# EAGLE design janus (EAGLE 7.5.0)
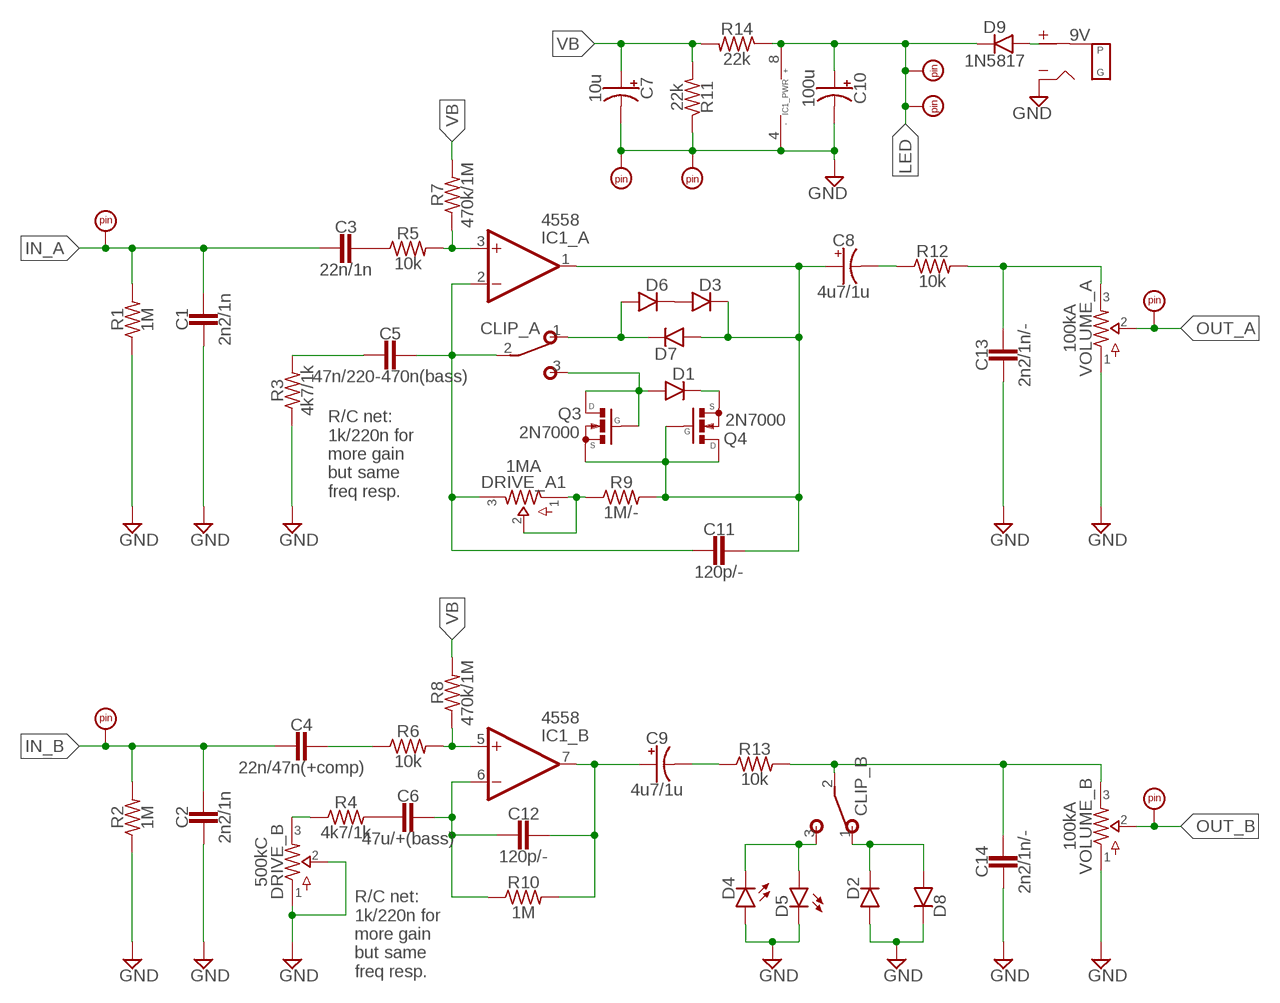
[diagram p0: schematic, sheet 1]

## Parts
9V  DC_MONO  [DC]
C1  2n2/1n  CER/FILM2  [050X030_025_2]
C2  2n2/1n  CER/FILM2  [050X030_025_2]
C3  22n/1n  CER/FILM2  [050X030_025_2]
C4  22n/47n(+comp)  CER/FILM2  [050X030_025_2]
C5  47n/220-470n(bass)  CER/FILM2  [050X030_025_2]
C6  47u/+(bass)  CER/FILM2  [050X030_025_2]
C7  10u  0501  [050_020_1]
C8  4u7/1u  0501  [050_020_1]
C9  4u7/1u  0501  [050_020_1]
C10  100u  0501  [050_020_1]
C11  120p/-  CER/FILM2  [050X030_025_2]
C12  120p/-  CER/FILM2  [050X030_025_2]
C13  2n2/1n/-  CER/FILM2  [050X030_025_2]
C14  2n2/1n/-  CER/FILM2  [050X030_025_2]
CLIP_A  SPDTPADS  [SPDT]
CLIP_B  SPDTPADS  [SPDT]
D1  DO35.2  [DO35-2]
D2  DO35.2  [DO35-2]
D3  DO35.2  [DO35-2]
D4  LEDB  [3MM_B]
D5  LEDB  [3MM_B]
D6  DO35.2  [DO35-2]
D7  DO35.2  [DO35-2]
D8  DO35.2  [DO35-2]
D9  1N5817  DO41.3  [DO41-3]
DRIVE_A1  1MA  POTS16MM  [16MM]
DRIVE_B  500kC  POTS16MM  [16MM]
GNDA  PADRND  [ROUND]
GNDB  PADRND  [ROUND]
IC1  4558  DUALTH  [DIL08]
INA  PADSQR  [SQUARE]
INB  PADSQR  [SQUARE]
LEDA  PADRND  [ROUND]
LEDB  PADRND  [ROUND]
OUTA  PADSQR  [SQUARE]
OUTB  PADSQR  [SQUARE]
Q3  2N7000  BS170  [SOT54ES]
Q4  2N7000  BS170  [SOT54ES]
R1  1M  R_.3B  [R0207/3]
R2  1M  R_.3B  [R0207/3]
R3  4k7/1k  R_.3B  [R0207/3]
R4  4k7/1k  R_.3B  [R0207/3]
R5  10k  R_.3B  [R0207/3]
R6  10k  R_.3B  [R0207/3]
R7  470k/1M  R_.3B  [R0207/3]
R8  470k/1M  R_.3B  [R0207/3]
R9  1M/-  R_.3B  [R0207/3]
R10  1M  R_.3B  [R0207/3]
R11  22k  R_.3B  [R0207/3]
R12  10k  R_.3B  [R0207/3]
R13  10k  R_.3B  [R0207/3]
R14  22k  R_.3B  [R0207/3]
VOLUME_A  100kA  POTS16MM  [16MM]
VOLUME_B  100kA  POTS16MM  [16MM]

## Nets
GND: 9V.S(SLEEVE) C1.2 C2.2 C7.- C10.- C13.2 C14.2 D2.A D4.A D5.K(C) D8.C DRIVE_B.1 DRIVE_B.2 GNDA.1 GNDB.1 IC1.4(_PWR:V-) R1.1 R2.1 R3.1 R11.1 VOLUME_A.1 VOLUME_B.1
IN_A: C1.1 C3.2 INA.1 R1.2
IN_B: C2.1 C4.2 INB.1 R2.2
LED: C10.+ D9.C IC1.8(_PWR:V+) LEDA.1 LEDB.1 R14.1
N$1: C3.1 R5.1
N$2: C5.2 R3.2
N$3: C8.- R12.1
N$4: C4.1 R6.1
N$5: IC1.3(_A:+IN) R5.2 R7.1
N$6: DRIVE_A1.1 DRIVE_A1.2 R9.1
N$7: C5.1 C11.2 CLIP_A.2(P) DRIVE_A1.3 IC1.2(_A:-IN)
N$8: D1.C Q4.S
N$10: C13.1 R12.2 VOLUME_A.3
N$11: CLIP_B.1(O) D2.C D8.A
N$12: C6.2 R4.2
N$13: C9.- R13.1
N$14: 9V.T(TIP) D9.A
N$15: C8.+ C11.1 D3.C D7.A IC1.1(_A:OUT) Q3.S Q4.D Q4.G R9.2
N$16: IC1.5(_B:+IN) R6.2 R8.1
N$17: C9.+ C12.1 IC1.7(_B:OUT) R10.2
N$18: C6.1 C12.2 IC1.6(_B:-IN) R10.1
N$19: CLIP_B.3(S) D4.K(C) D5.A
N$21: C14.1 CLIP_B.2(P) R13.2 VOLUME_B.3
N$22: DRIVE_B.3 R4.1
N$23: CLIP_A.3(S) D1.A Q3.D Q3.G
N$24: D3.A D6.C
N$25: CLIP_A.1(O) D6.A D7.C
OUT_A: OUTA.1 VOLUME_A.2
OUT_B: OUTB.1 VOLUME_B.2
VB: C7.+ R7.2 R8.2 R11.2 R14.2

## Notes on the sheet
- R/C net:
  1k/220n for 
  more gain 
  but same 
  freq resp.
- R/C net:
  1k/220n for 
  more gain 
  but same 
  freq resp.

## Library data of the parts
9V = jacks:DC_MONO
C1-C6 C11-C14 = capacitors-film:CER/FILM: 47 - 120pF Xicon Ceramic Disc 2.5mm lead spacing
C7-C10 = capacitors-elec:050: 0.22 - 100uF Xicon values at Mouser.com: 10V: 10 - 100uF; 16V: 2.2 - 47uF; 25V: 0.47 - 47uF; 50V: 0.22 - 22uF
CLIP_A CLIP_B = switches:SPDT: TOGGLE SWITCH Marquardt
D1-D3 D6-D8 = diodes:DO35: DO-35 Package Diodes: 1N914
D4 D5 = diodes:LED
D9 = diodes:DO41: DO-41 Package Diodes: 1N4001 - 1N40019 Zener Diodes: 1N4728 - 1N4764
DRIVE_A1 DRIVE_B VOLUME_A VOLUME_B = potentiometers:POTS
GNDA GNDB INA INB LEDA LEDB OUTA OUTB = supply pins:PAD
IC1 = integrated circuits:DUAL: OP AMP
Q3 Q4 = transistors:BS170: N-CHANNEL MOS FET
R1-R14 = resistors:R_

## Board
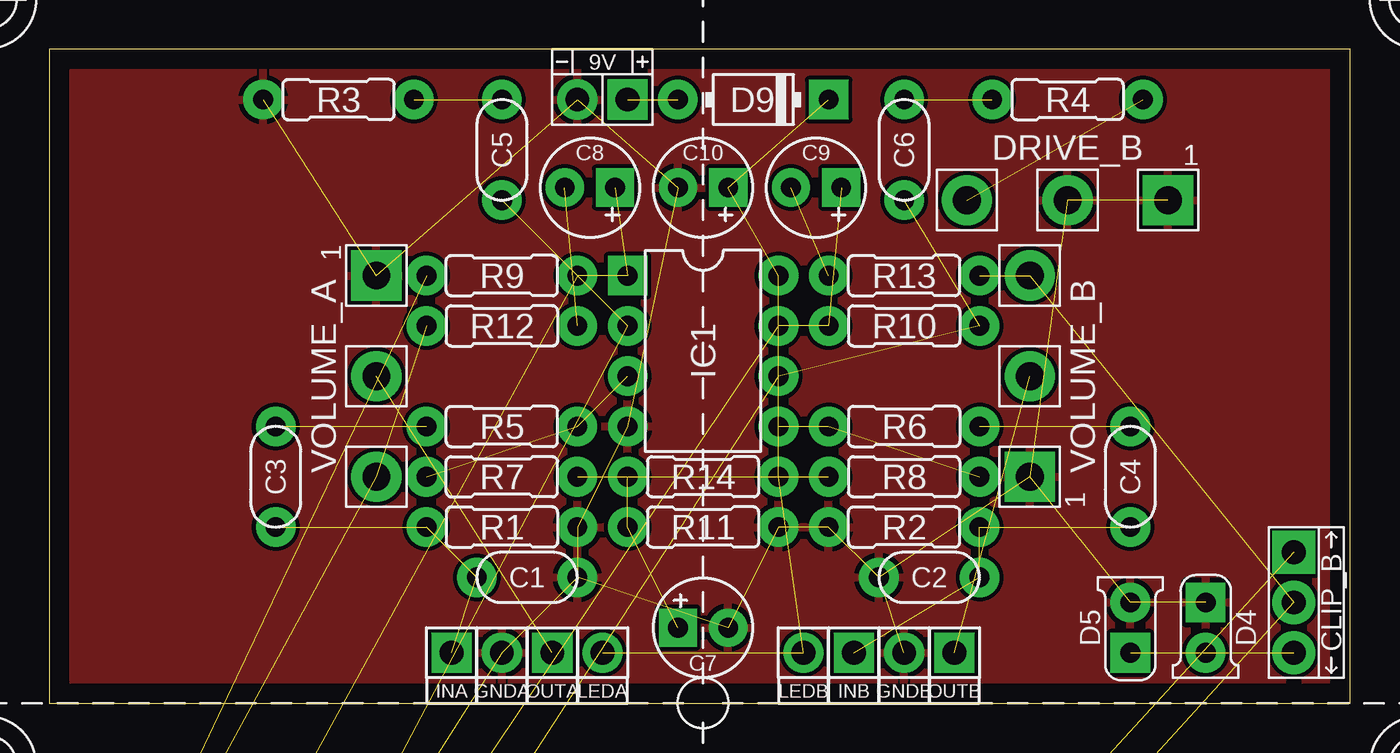
[diagram p1: board, top side]
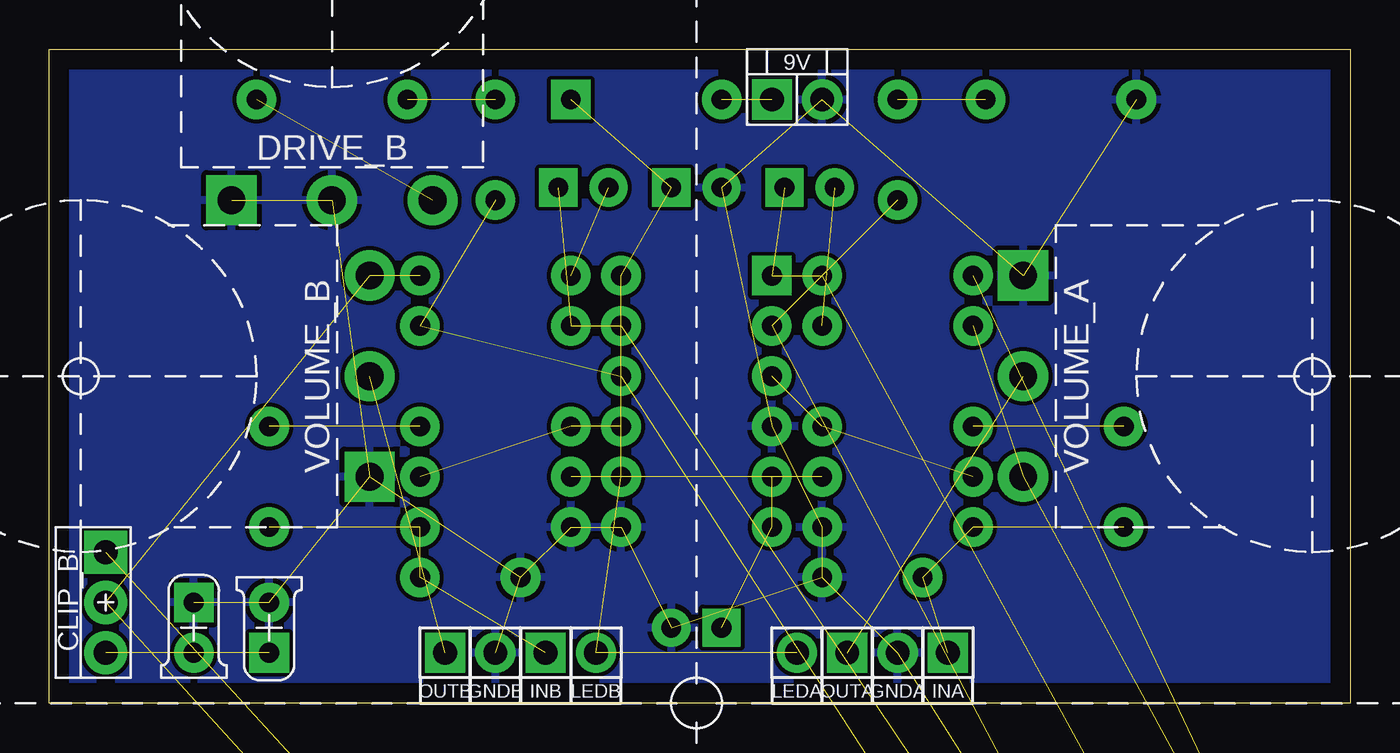
[diagram p2: board, bottom side, seen from below]

Size 65.71 x 33.01 mm. Coordinates in mm from the lower left corner, seen from the top.
Outline: 0,0 65.71,0 65.71,33.01 0,33.01 0,0
Copper layers (1*16): Top 0.035mm / dielectric 1.5mm / Bottom 0.035mm
Design rules "default": minimum track width 10mil, minimum drill 24mil, track to track 8mil, track to pad 8mil, pad to pad 8mil, via to via 8mil, smd to smd 8mil, copper to edge 40mil, drill to drill 8mil, minimum pad ring 10mil, minimum via ring 8mil, stop-mask expansion 4mil, vias tented up to drill 0mil, thermal gap 10mil

### Footprints (pad centres in the part's own frame; a part is rotated, then mirrored left to right if it is on the bottom)
DC = drill 1.2 pad 2.032: S -1.27,0 | drill 1.2 pad 2.032 square: T 1.27,0
050X030_025_2 = drill 1 pad 2: 1 -2.54,0; 2 2.54,0
050_020_1 = drill 1 pad 1.93 square: + -1.27,0 | drill 1 pad 1.93: - 1.27,0
SPDT = drill 1.2 pad 2.184 square: 1 -2.54,0 | drill 1.2 pad 2.184: 2 0,0; 3 2.54,0
DO35-2 = drill 1 pad 2: A 2.54,0 | drill 1 pad 2 square: C -2.54,0
3MM_B = drill 1 pad 2 square: A -1.27,0 | drill 1 pad 2: K 1.27,0
DO41-3 = drill 1 pad 2: A 3.81,0 | drill 1 pad 2 square: C -3.81,0
16MM = drill 1.4 pad 2.54 square: 1 5.08,0 | drill 1.4 pad 2.54: 2 0,0; 3 -5.08,0
ROUND = drill 1.2 pad 2.032: 1 0,0
DIL08 = drill 1 pad 2 square: 1 -3.81,-3.81 | drill 1 pad 2: 2 -1.27,-3.81; 3 1.27,-3.81; 4 3.81,-3.81; 5 3.81,3.81; 6 1.27,3.81; 7 -1.27,3.81; 8 -3.81,3.81
SQUARE = drill 1.2 pad 2.032 square: 1 0,0
SOT54ES = drill 1 pad 2: D -2.54,0; G 0,0; S 2.54,0
R0207/3 = drill 1 pad 2: 1 -3.81,0; 2 3.81,0

### Placement (x,y rotation side)
9V  27.94,30.48 0 top
C1  24.13,6.35 0 top
C2  44.45,6.35 180 top
C3  11.43,11.43 270 top
C4  54.61,11.43 270 top
C5  22.86,27.94 90 top
C6  43.18,27.94 90 top
C7  33.02,3.81 0 top
C8  27.3,26.04 180 top
C9  38.73,26.04 180 top
C10  33.02,26.04 180 top
C11  -36.83,-100.97 0 top  (outside the outline)
C12  -54.61,-120.65 0 top  (outside the outline)
C13  -54.61,-123.83 0 top  (outside the outline)
C14  -54.61,-127 0 top  (outside the outline)
CLIP_A  -36.2,-105.41 0 top  (outside the outline)
CLIP_B  62.87,5.08 270 top
D1  -36.83,-98.42 0 top  (outside the outline)
D2  -54.61,-115.57 0 top  (outside the outline)
D3  -36.83,-107.95 0 top  (outside the outline)
D4  58.42,3.81 270 top
D5  54.61,3.81 90 top
D6  -36.83,-110.49 0 top  (outside the outline)
D7  -36.83,-113.03 0 top  (outside the outline)
D8  -54.61,-118.11 0 top  (outside the outline)
D9  35.56,30.48 180 top
DRIVE_A1  -49.53,-112.39 0 top  (outside the outline)
DRIVE_B  51.44,25.4 0 top
GNDA  22.86,2.54 0 top
GNDB  43.18,2.54 0 top
IC1  33.02,17.78 270 top
INA  20.32,2.54 0 top
INB  40.64,2.54 0 top
LEDA  27.94,2.54 0 top
LEDB  38.1,2.54 0 top
OUTA  25.4,2.54 0 top
OUTB  45.72,2.54 0 top
Q3  -36.83,-89.53 0 top  (outside the outline)
Q4  -36.83,-94.61 0 top  (outside the outline)
R1  22.86,8.89 180 top
R2  43.18,8.89 0 top
R3  14.61,30.48 0 top
R4  51.44,30.48 180 top
R5  22.86,13.97 0 top
R6  43.18,13.97 180 top
R7  22.86,11.43 0 top
R8  43.18,11.43 180 top
R9  22.86,21.59 0 top
R10  43.18,19.05 180 top
R11  33.02,8.89 180 top
R12  22.86,19.05 180 top
R13  43.18,21.59 0 top
R14  33.02,11.43 180 top
U$1  [1590BB]  33.02,0 0 top
U$2  [3PDT]  3.17,-41.91 0 top  (outside the outline)
U$3  [3PDT]  62.87,-41.91 0 top  (outside the outline)
U$4  [LED]  17.78,-41.91 0 top  (outside the outline)
U$5  [LED]  48.26,-41.91 0 top  (outside the outline)
U$6  [LED]  -3.17,-3.17 0 top  (outside the outline)
U$7  [LED]  69.22,-3.17 0 top  (outside the outline)
U$8  [MONO_ENCLOSED]  -9.53,-22.23 90 top  (outside the outline)
U$9  [MONO_ENCLOSED]  75.56,-22.23 270 top  (outside the outline)
U$10  [DC_TOP]  33.02,60.33 0 top  (outside the outline)
U$11  [LED]  -3.17,35.56 0 top  (outside the outline)
U$12  [LED]  69.22,35.56 0 top  (outside the outline)
VOLUME_A  16.51,16.51 90 top
VOLUME_B  49.53,16.51 270 top

### Tracks (layer width: path | path; a pad name or v marks a point on that pad's centre or on a via)
GND  (21 unrouted)
  pour Top: 0,33.02 66.04,33.02 66.04,0 0,0
  pour Bottom: 0,33.02 66.04,33.02 66.04,0 0,0
IN_A  (3 unrouted)
IN_B  (3 unrouted)
LED  (5 unrouted)
N$1  (1 unrouted)
N$2  (1 unrouted)
N$3  (1 unrouted)
N$4  (1 unrouted)
N$5  (2 unrouted)
N$6  (2 unrouted)
N$7  (4 unrouted)
N$8  (1 unrouted)
N$10  (2 unrouted)
N$11  (2 unrouted)
N$12  (1 unrouted)
N$13  (1 unrouted)
N$14  (1 unrouted)
N$15  (8 unrouted)
N$16  (2 unrouted)
N$17  (3 unrouted)
N$18  (3 unrouted)
N$19  (2 unrouted)
N$21  (3 unrouted)
N$22  (1 unrouted)
N$23  (3 unrouted)
N$24  (1 unrouted)
N$25  (2 unrouted)
OUT_A  (1 unrouted)
OUT_B  (1 unrouted)
VB  (4 unrouted)